# EAGLE design DoublePN-03092017-001 (EAGLE 8.3.1)
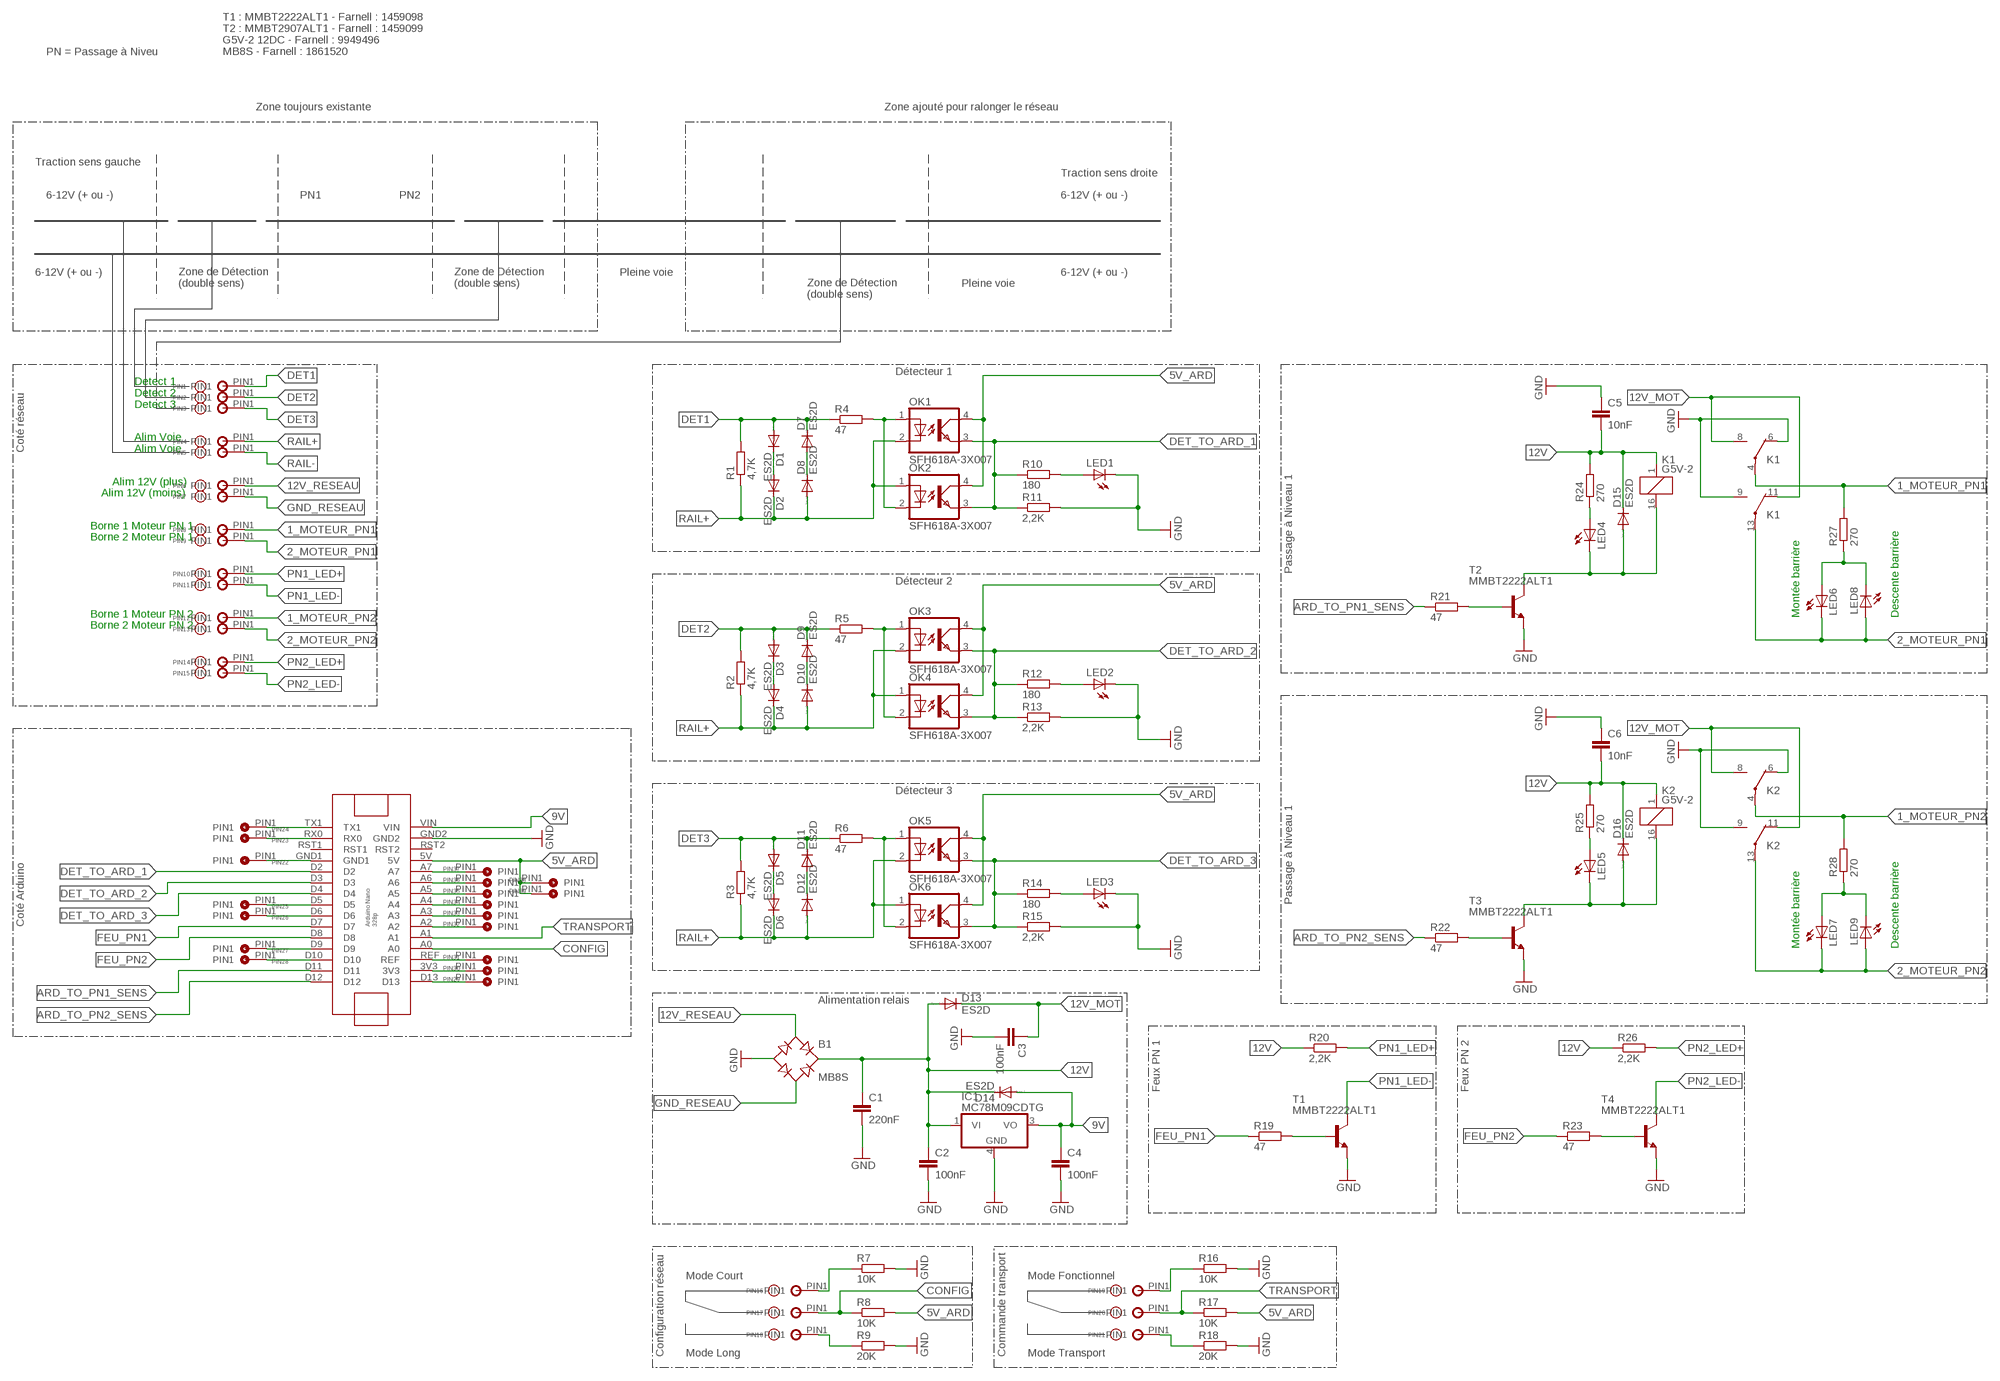
[diagram p0: schematic, sheet 1]

## Parts
ARDUINO-NANO1  ARDUINO-NANO  [ARDUINO-NANO]
B1  MB8S  [SOIC-4]
C1  220nF  C-EUC0805  [C0805]
C2  100nF  C-EUC0805  [C0805]
C3  100nF  C-EUC0805  [C0805]
C4  100nF  C-EUC0805  [C0805]
C5  10nF  C-EUC0805  [C0805]
C6  10nF  C-EUC0805  [C0805]
D1  ES2D  [SMB]
D2  ES2D  [SMB]
D3  ES2D  [SMB]
D4  ES2D  [SMB]
D5  ES2D  [SMB]
D6  ES2D  [SMB]
D7  ES2D  [SMB]
D8  ES2D  [SMB]
D9  ES2D  [SMB]
D10  ES2D  [SMB]
D11  ES2D  [SMB]
D12  ES2D  [SMB]
D13  ES2D  [SMB]
D14  ES2D  [SMB]
D15  ES2D  [SMB]
D16  ES2D  [SMB]
IC1  MC78M09CDTG  [DPACK_3]
K1  G5V-2  [G5V-2]
K2  G5V-2  [G5V-2]
LED1  LEDCHIPLED_0805  [CHIPLED_0805]
LED2  LEDCHIPLED_0805  [CHIPLED_0805]
LED3  LEDCHIPLED_0805  [CHIPLED_0805]
LED4  LEDCHIPLED_0805  [CHIPLED_0805]
LED5  LEDCHIPLED_0805  [CHIPLED_0805]
LED6  LEDCHIPLED_0805  [CHIPLED_0805]
LED7  LEDCHIPLED_0805  [CHIPLED_0805]
LED8  LEDCHIPLED_0805  [CHIPLED_0805]
LED9  LEDCHIPLED_0805  [CHIPLED_0805]
OK1  SFH618A-3X007  [SMD4-7]
OK2  SFH618A-3X007  [SMD4-7]
OK3  SFH618A-3X007  [SMD4-7]
OK4  SFH618A-3X007  [SMD4-7]
OK5  SFH618A-3X007  [SMD4-7]
OK6  SFH618A-3X007  [SMD4-7]
PIN1  CON-FILTRAVERSANT-1FILTRAVERSANT-1  [CON-FILTRAVERSANT-1]
PIN2  CON-FILTRAVERSANT-1FILTRAVERSANT-1  [CON-FILTRAVERSANT-1]
PIN3  CON-FILTRAVERSANT-1FILTRAVERSANT-1  [CON-FILTRAVERSANT-1]
PIN4  CON-FILTRAVERSANT-1FILTRAVERSANT-1  [CON-FILTRAVERSANT-1]
PIN5  CON-FILTRAVERSANT-1FILTRAVERSANT-1  [CON-FILTRAVERSANT-1]
PIN6  CON-FILTRAVERSANT-1FILTRAVERSANT-1  [CON-FILTRAVERSANT-1]
PIN7  CON-FILTRAVERSANT-1FILTRAVERSANT-1  [CON-FILTRAVERSANT-1]
PIN8  CON-FILTRAVERSANT-1FILTRAVERSANT-1  [CON-FILTRAVERSANT-1]
PIN9  CON-FILTRAVERSANT-1FILTRAVERSANT-1  [CON-FILTRAVERSANT-1]
PIN10  CON-FILTRAVERSANT-1FILTRAVERSANT-1  [CON-FILTRAVERSANT-1]
PIN11  CON-FILTRAVERSANT-1FILTRAVERSANT-1  [CON-FILTRAVERSANT-1]
PIN12  CON-FILTRAVERSANT-1FILTRAVERSANT-1  [CON-FILTRAVERSANT-1]
PIN13  CON-FILTRAVERSANT-1FILTRAVERSANT-1  [CON-FILTRAVERSANT-1]
PIN14  CON-FILTRAVERSANT-1FILTRAVERSANT-1  [CON-FILTRAVERSANT-1]
PIN15  CON-FILTRAVERSANT-1FILTRAVERSANT-1  [CON-FILTRAVERSANT-1]
PIN16  CON-FILTRAVERSANT-1FILTRAVERSANT-1  [CON-FILTRAVERSANT-1]
PIN17  CON-FILTRAVERSANT-1FILTRAVERSANT-1  [CON-FILTRAVERSANT-1]
PIN18  CON-FILTRAVERSANT-1FILTRAVERSANT-1  [CON-FILTRAVERSANT-1]
PIN19  CON-FILTRAVERSANT-1FILTRAVERSANT-1  [CON-FILTRAVERSANT-1]
PIN20  CON-FILTRAVERSANT-1FILTRAVERSANT-1  [CON-FILTRAVERSANT-1]
PIN21  CON-FILTRAVERSANT-1FILTRAVERSANT-1  [CON-FILTRAVERSANT-1]
PIN22  CON-TRAV-1PIN  [CON-TRAV-1]
PIN23  CON-TRAV-1PIN  [CON-TRAV-1]
PIN24  CON-TRAV-1PIN  [CON-TRAV-1]
PIN25  CON-TRAV-1PIN  [CON-TRAV-1]
PIN26  CON-TRAV-1PIN  [CON-TRAV-1]
PIN27  CON-TRAV-1PIN  [CON-TRAV-1]
PIN28  CON-TRAV-1PIN  [CON-TRAV-1]
PIN29  CON-TRAV-1PIN  [CON-TRAV-1]
PIN30  CON-TRAV-1PIN  [CON-TRAV-1]
PIN31  CON-TRAV-1PIN  [CON-TRAV-1]
PIN32  CON-TRAV-1PIN  [CON-TRAV-1]
PIN33  CON-TRAV-1PIN  [CON-TRAV-1]
PIN34  CON-TRAV-1PIN  [CON-TRAV-1]
PIN35  CON-TRAV-1PIN  [CON-TRAV-1]
PIN36  CON-TRAV-1PIN  [CON-TRAV-1]
PIN37  CON-TRAV-1PIN  [CON-TRAV-1]
PIN38  CON-TRAV-1PIN  [CON-TRAV-1]
PIN39  CON-TRAV-1PIN  [CON-TRAV-1]
R1  4,7K  R-EU_R0805  [R0805]
R2  4,7K  R-EU_R0805  [R0805]
R3  4,7K  R-EU_R0805  [R0805]
R4  47  R-EU_R0805  [R0805]
R5  47  R-EU_R0805  [R0805]
R6  47  R-EU_R0805  [R0805]
R7  10K  R-EU_R0805  [R0805]
R8  10K  R-EU_R0805  [R0805]
R9  20K  R-EU_R0805  [R0805]
R10  180  R-EU_R0805  [R0805]
R11  2,2K  R-EU_R0805  [R0805]
R12  180  R-EU_R0805  [R0805]
R13  2,2K  R-EU_R0805  [R0805]
R14  180  R-EU_R0805  [R0805]
R15  2,2K  R-EU_R0805  [R0805]
R16  10K  R-EU_R0805  [R0805]
R17  10K  R-EU_R0805  [R0805]
R18  20K  R-EU_R0805  [R0805]
R19  47  R-EU_R0805  [R0805]
R20  2,2K  R-EU_R0805  [R0805]
R21  47  R-EU_R0805  [R0805]
R22  47  R-EU_R0805  [R0805]
R23  47  R-EU_R0805  [R0805]
R24  270  R-EU_R0805  [R0805]
R25  270  R-EU_R0805  [R0805]
R26  2,2K  R-EU_R0805  [R0805]
R27  270  R-EU_R0805  [R0805]
R28  270  R-EU_R0805  [R0805]
T1  MMBT2222ALT1  MMBT2222ALT1-NPN-SOT23-BEC  [SOT23-BEC]
T2  MMBT2222ALT1  MMBT2222ALT1-NPN-SOT23-BEC  [SOT23-BEC]
T3  MMBT2222ALT1  MMBT2222ALT1-NPN-SOT23-BEC  [SOT23-BEC]
T4  MMBT2222ALT1  MMBT2222ALT1-NPN-SOT23-BEC  [SOT23-BEC]

## Nets
1_MOTEUR_PN1: K1.4(1:P) PIN8.PIN1 R27.2
1_MOTEUR_PN2: K2.4(1:P) PIN12.PIN1 R28.2
2_MOTEUR_PN1: K1.13(2:P) LED6.C LED8.A PIN9.PIN1
2_MOTEUR_PN2: K2.13(2:P) LED7.C LED9.A PIN13.PIN1
5V_ARD: ARDUINO-NANO1.5V OK1.4(COL) OK2.4(COL) OK3.4(COL) OK4.4(COL) OK5.4(COL) OK6.4(COL) PIN38.PIN1 PIN39.PIN1 R8.2 R17.2
9V: ARDUINO-NANO1.VIN C4.1 D14.A IC1.3(VO)
12V: B1.+ C1.1 C2.1 C5.2 C6.2 D13.A D14.C D15.C D16.C IC1.1(VI) K1.1 K2.1 R20.1 R24.2 R25.2 R26.1
12V_MOT: C3.1 D13.C K1.8(1:S) K1.11(2:O) K2.8(1:S) K2.11(2:O)
12V_RESEAU: B1.~1(AC1) PIN6.PIN1
ARD_TO_PN1_SENS: ARDUINO-NANO1.D11 R21.1
ARD_TO_PN2_SENS: ARDUINO-NANO1.D12 R22.1
CONFIG: ARDUINO-NANO1.A0 PIN17.PIN1 R8.1
DET1: D1.A D7.C PIN1.PIN1 R1.2 R4.1
DET2: D3.A D9.C PIN2.PIN1 R2.2 R5.1
DET3: D5.A D11.C PIN3.PIN1 R3.2 R6.1
DET_TO_ARD_1: ARDUINO-NANO1.D2 OK1.3(EMIT) OK2.3(EMIT) R10.1 R11.1
DET_TO_ARD_2: ARDUINO-NANO1.D3 OK3.3(EMIT) OK4.3(EMIT) R12.1 R13.1
DET_TO_ARD_3: ARDUINO-NANO1.D4 OK5.3(EMIT) OK6.3(EMIT) R14.1 R15.1
FEU_PN1: ARDUINO-NANO1.D7 R19.1
FEU_PN2: ARDUINO-NANO1.D8 R23.1
GND: ARDUINO-NANO1.GND2 B1.- C1.2 C2.2 C3.2 C4.2 C5.1 C6.1 IC1.4(GND) K1.6(1:O) K1.9(2:S) K2.6(1:O) K2.9(2:S) LED1.C LED2.C LED3.C R7.2 R9.2 R11.2 R13.2 R15.2 R16.2 R18.2 T1.E T2.E T3.E T4.E
GND_RESEAU: B1.~2(AC2) PIN7.PIN1
N$1: OK1.1(A) OK2.2(C) R4.2
N$2: D1.C D2.A
N$3: D7.A D8.C
N$4: LED6.A LED8.C R27.1
N$5: R21.2 T2.B
N$6: LED1.A R10.2
N$7: D15.A K1.16 LED4.C T2.C
N$8: D3.C D4.A
N$9: LED4.A R24.1
N$10: D9.A D10.C
N$11: OK3.1(A) OK4.2(C) R5.2
N$12: LED2.A R12.2
N$13: D5.C D6.A
N$14: D11.A D12.C
N$15: OK5.1(A) OK6.2(C) R6.2
N$16: LED3.A R14.2
N$17: LED5.A R25.1
N$18: D16.A K2.16 LED5.C T3.C
N$19: ARDUINO-NANO1.GND1 PIN22.PIN1
N$20: LED7.A LED9.C R28.1
N$21: R23.2 T4.B
N$22: R19.2 T1.B
N$23: R22.2 T3.B
N$25: ARDUINO-NANO1.A7 PIN37.PIN1
N$26: ARDUINO-NANO1.A6 PIN36.PIN1
N$27: ARDUINO-NANO1.A5 PIN35.PIN1
N$28: ARDUINO-NANO1.A4 PIN34.PIN1
N$29: ARDUINO-NANO1.A3 PIN33.PIN1
N$30: ARDUINO-NANO1.A2 PIN32.PIN1
N$31: ARDUINO-NANO1.D10 PIN28.PIN1
N$32: ARDUINO-NANO1.D9 PIN27.PIN1
N$33: ARDUINO-NANO1.D6 PIN26.PIN1
N$34: ARDUINO-NANO1.D5 PIN25.PIN1
N$35: ARDUINO-NANO1.RX0 PIN23.PIN1
N$36: ARDUINO-NANO1.TX1 PIN24.PIN1
N$37: PIN16.PIN1 R7.1
N$38: PIN19.PIN1 R16.1
N$39: ARDUINO-NANO1.REF PIN31.PIN1
N$40: ARDUINO-NANO1.3V3 PIN30.PIN1
N$41: ARDUINO-NANO1.D13 PIN29.PIN1
N$42: PIN18.PIN1 R9.1
N$43: PIN21.PIN1 R18.1
PN1_LED+: PIN10.PIN1 R20.2
PN1_LED-: PIN11.PIN1 T1.C
PN2_LED+: PIN14.PIN1 R26.2
PN2_LED-: PIN15.PIN1 T4.C
RAIL+: D2.C D4.C D6.C D8.A D10.A D12.A OK1.2(C) OK2.1(A) OK3.2(C) OK4.1(A) OK5.2(C) OK6.1(A) PIN4.PIN1 R1.1 R2.1 R3.1
RAIL-: PIN5.PIN1
TRANSPORT: ARDUINO-NANO1.A1 PIN20.PIN1 R17.1
Unconnected: ARDUINO-NANO1.RST1 ARDUINO-NANO1.RST2

## Notes on the sheet
- PN = Passage à Niveu
- T1 : MMBT2222ALT1 - Farnell : 1459098
  T2 : MMBT2907ALT1 - Farnell : 1459099
  G5V-2 12DC - Farnell : 9949496
  MB8S - Farnell : 1861520
- Zone toujours existante | Zone ajouté pour ralonger le réseau
- Traction sens gauche
- Traction sens droite
- 6-12V (+ ou -) | PN1 | PN2 | 6-12V (+ ou -)
- 6-12V (+ ou -) | Pleine voie | 6-12V (+ ou -)
- Zone de Détection
  (double sens)
- Zone de Détection
  (double sens)
- Pleine voie
- Zone de Détection
  (double sens)
- Détecteur 1
- Detect 1
  Detect 2
  Detect 3
- Coté réseau
- Alim Voie
  Alim Voie
- Alim 12V (plus)
- Alim 12V (moins)
- Borne 1 Moteur PN 1
- Borne 2 Moteur PN 1
- Passage à Niveau 1
- Détecteur 2
- Borne 1 Moteur PN 2 | Montée barrière | Descente barrière
- Borne 2 Moteur PN 2
- Détecteur 3
- Passage à Niveau 1
- Coté Arduino
- Montée barrière | Descente barrière
- Alimentation relais
- Feux PN 1 | Feux PN 2
- Mode Court | Mode Fonctionnel
- Configuration réseau | Mode Long | Commande transport | Mode Transport

## Library data of the parts
ARDUINO-NANO1 = Arduino-nano:ARDUINO-NANO
B1 = rectifier:MB*S: Bridge Rectifier Source: http://www.fairchildsemi.com/ds/MB/MB6S.pdf
C1-C6 = rcl:C-EU: CAPACITOR, European symbol
D1-D16 = diode:ES2D: DIODE super fast rectifier, 2 A
IC1 = linear:MC78M: 500 mA Positive Voltage Regulators Source: Data sheet <http://www.onsemi.com/pub_link/Collateral/MC78M00-D.PDF>
K1 K2 = relay:G5V-2: OMRON PCB Relay Source: http://www.omron.com/ecb/products/pdf/en-g5v2.pdf; MPN: G5V-2 5DC; OC_FARNELL: 9949488; OC_NEWARK: 78K5703
LED1-LED9 = led:LED: LED OSRAM: - CHIPLED LG R971, LG N971, LY N971, LG Q971, LY Q971, LO R971, LY R971 LH N974, LH R974 LS Q976, LO Q976, LY Q976 LO Q996 - Hyper CHIPLED LW Q18S LB Q993, LB Q99A, LB R99A - SideLED LS A670, LO A670, LY A670, LG A670, LP A670 LB A673, LV A673, LT A673, LW A673 LH A674 LY A675 LS A676, LA A676, LO A676, LY A676, LW A676 LS A679, LY A679, LG A679 - Hyper Micro SIDELED® LS Y876, LA Y876, LO Y876, LY Y876 LT Y87S - SmartLED LW L88C, LW L88S LB L89C, LB L89S, LG L890 LS L89K, LO L89K, LY L89K LS L896, LA L896, LO L896, LY L896 - TOPLED LS T670, LO T670, LY T670, LG T670, LP T670 LSG T670, LSP T670, LSY T670, LOP T670, LYG T670 LG T671, LOG T671, LSG T671 LB T673, LV T673, LT T673, LW T673 LH T674 LS T676, LA T676, LO T676, LY T676, LB T676, LH T676, LSB T676, LW T676 LB T67C, LV T67C, LT T67C, LS T67K, LO T67K, LY T67K, LW E67C LS E67B, LA E67B, LO E67B, LY E67B, LB E67C, LV E67C, LT E67C LW T67C LS T679, LY T679, LG T679 LS T770, LO T770, LY T770, LG T770, LP T770 LB T773, LV T773, LT T773, LW T773 LH T774 LS E675, LA E675, LY E675, LS T675 LS T776, LA T776, LO T776, LY T776, LB T776 LHGB T686 LT T68C, LB T68C - Hyper Mini TOPLED® LB M676 - Mini TOPLED Santana® LG M470 LS M47K, LO M47K, LY M47K Source: http://www.osram.convergy.de LUXEON: - LUMILED® LXK2-PW12-R00, LXK2-PW12-S00, LXK2-PW14-U00, LXK2-PW14-V00 LXK2-PM12-R00, LXK2-PM12-S00, LXK2-PM14-U00 LXK2-PE12-Q00, LXK2-PE12-R00, LXK2-PE12-S00, LXK2-PE14-T00, LXK2-PE14-U00 LXK2-PB12-K00, LXK2-PB12-L00, LXK2-PB12-M00, LXK2-PB14-N00, LXK2-PB14-P00, LXK2-PB14-Q00 LXK2-PR12-L00, LXK2-PR12-M00, LXK2-PR14-Q00, LXK2-PR14-R00 LXK2-PD12-Q00, LXK2-PD12-R00, LXK2-PD12-S00 LXK2-PH12-R00, LXK2-PH12-S00 LXK2-PL12-P00, LXK2-PL12-Q00, LXK2-PL12-R00 Source: www.luxeon.com KINGBRIGHT: KA-3528ASYC Source: www.kingbright.com
OK1-OK6 = optocoupler:SFH618?*: Optocoupler, Phototransistor Output, Low Input Current Source: Data sheet <http://www.vishay.com/docs/83673/sfh618.pdf>; OC_FARNELL: unknown; OC_NEWARK: unknown
PIN1-PIN21 = Pin:CON-FILTRAVERSANT-1
PIN22-PIN39 = Pin:CON-TRAV-1
R1-R28 = rcl:R-EU_: RESISTOR, European symbol
T1-T4 = transistor:*-NPN-: NPN Transistror BF959 corrected 2008.03.06

## Board
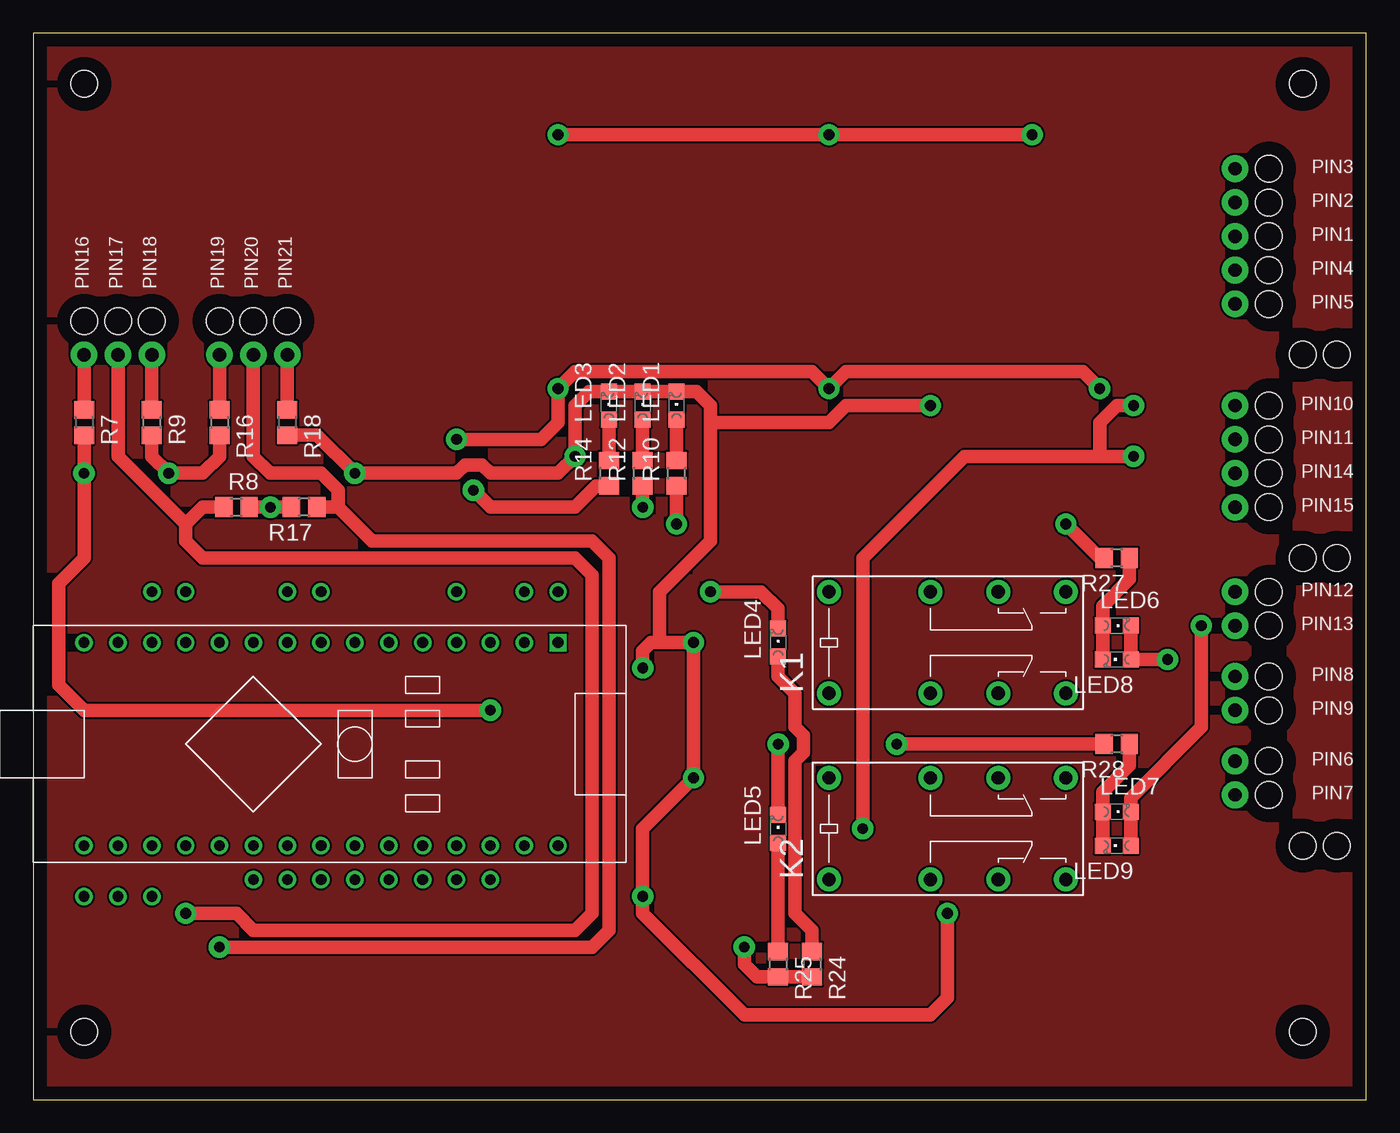
[diagram p1: board, top side]
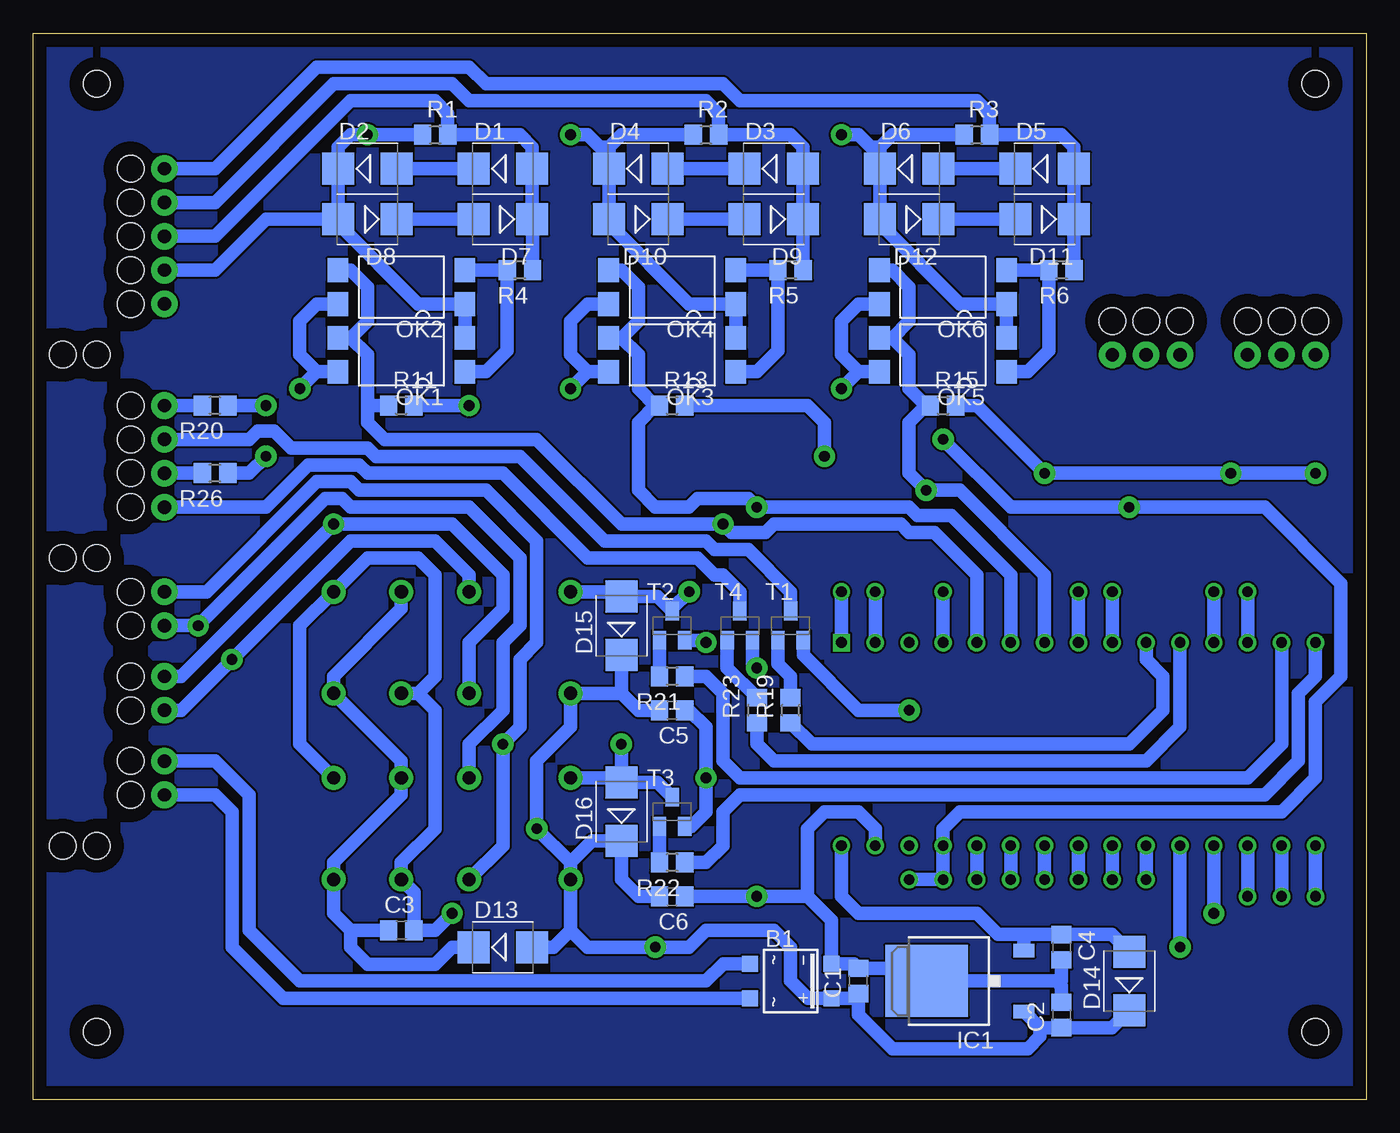
[diagram p2: board, bottom side, seen from below]

Size 100 x 80 mm. Coordinates in mm from the lower left corner, seen from the top.
Outline: 0,0 100,0 100,80 0,80 0,0
Copper layers (1*16): Top 0.035mm / dielectric 1.5mm / Bottom 0.035mm
Design rules "default": minimum track width 6mil, minimum drill 0.35mm, track to track 6mil, track to pad 6mil, pad to pad 6mil, via to via 6mil, smd to smd 6mil, copper to edge 40mil, drill to drill 6mil, minimum pad ring 10mil, minimum via ring 8mil, stop-mask expansion 4mil, vias tented up to drill 0mil, thermal gap 10mil
Holes 2 mm at 3.81,76.2 95.25,76.2 95.25,5.08 3.81,5.08 95.25,19.05 97.79,19.05 95.25,40.64 97.79,40.64 95.25,55.88 97.79,55.88

### Footprints (pad centres in the part's own frame; a part is rotated, then mirrored left to right if it is on the bottom)
ARDUINO-NANO = drill 0.8: 3V3 7.62,-16.51; 5V 7.62,8.89; A0 7.62,-11.43; A1 7.62,-8.89; A2 7.62,-6.35; A3 7.62,-3.81; A4 7.62,-1.27; A5 7.62,1.27; A6 7.62,3.81; A7 7.62,6.35; D2 -7.62,6.35; D3 -7.62,3.81; D4 -7.62,1.27; D5 -7.62,-1.27; D6 -7.62,-3.81; D7 -7.62,-6.35; D8 -7.62,-8.89; D9 -7.62,-11.43; D10 -7.62,-13.97; D11 -7.62,-16.51; D12 -7.62,-19.05; D13 7.62,-19.05; GND1 -7.62,8.89; GND2 7.62,13.97; REF 7.62,-13.97; RST1 -7.62,11.43; RST2 7.62,11.43; RX0 -7.62,13.97; VIN 7.62,16.51 | drill 0.8 square: TX1 -7.62,16.51
SOIC-4 = smd 1.2 x 1.2: + 1.3,3.05; - -1.3,3.05; ~1 -1.3,-3.05; ~2 1.3,-3.05
C0805 = smd 1.3 x 1.5: 1 -0.95,0; 2 0.95,0
SMB = smd 2.4 x 2.4: A 2.2,0; C -2.2,0
DPACK_3 = smd 1 x 1.6: 1 -2.28,-4.8; 3 2.28,-4.8 | smd 5.4 x 6.2: 4 0,2.5
G5V-2 = drill 1 pad 1.8: 1 -8.89,-3.81; 4 -1.27,-3.81; 6 3.81,-3.81; 8 8.89,-3.81; 9 8.89,3.81; 11 3.81,3.81; 13 -1.27,3.81; 16 -8.89,3.81
CHIPLED_0805 = smd 1.2 x 1.2: A 0,-1.05; C 0,1.05
SMD4-7 = smd 1.78 x 1.55: 1 -1.27,-4.77; 2 1.27,-4.77; 3 1.27,4.77; 4 -1.27,4.77
CON-FILTRAVERSANT-1 = drill 1 pad 2: PIN1 0,0 | hole 2: -2.54,0
CON-TRAV-1 = drill 0.8 pad 1.2: PIN1 0,0
R0805 = smd 1.3 x 1.5: 1 -0.95,0; 2 0.95,0
SOT23-BEC = smd 1 x 1.4: B -0.95,-1.1; C 0,1.1; E 0.95,-1.1

### Placement (x,y rotation side)
ARDUINO-NANO1  22.86,26.67 270 top
B1  43.18,8.89 270 bottom
C1  38.1,8.89 90 bottom
C2  22.86,6.35 90 bottom
C3  72.39,12.7 0 bottom
C4  22.86,11.43 270 bottom
C5  52.07,29.21 180 bottom
C6  52.07,15.24 180 bottom
D1  64.77,69.85 0 bottom
D2  74.93,69.85 0 bottom
D3  44.45,69.85 0 bottom
D4  54.61,69.85 0 bottom
D5  24.13,69.85 0 bottom
D6  34.29,69.85 0 bottom
D7  64.77,66.04 180 bottom
D8  74.93,66.04 180 bottom
D9  44.45,66.04 180 bottom
D10  54.61,66.04 180 bottom
D11  24.13,66.04 180 bottom
D12  34.29,66.04 180 bottom
D13  64.77,11.43 0 bottom
D14  17.78,8.89 90 bottom
D15  55.88,35.56 90 bottom
D16  55.88,21.59 90 bottom
IC1  30.48,8.89 90 bottom
K1  68.58,34.29 0 top
K2  68.58,20.32 0 top
LED1  48.26,52.07 0 top
LED2  45.72,52.07 0 top
LED3  43.18,52.07 0 top
LED4  55.88,34.29 0 top
LED5  55.88,20.32 0 top
LED6  81.28,35.56 270 top
LED7  81.28,21.59 270 top
LED8  81.28,33.02 90 top
LED9  81.28,19.05 90 top
OK1  72.39,55.88 90 bottom
OK2  72.39,60.96 90 bottom
OK3  52.07,55.88 90 bottom
OK4  52.07,60.96 90 bottom
OK5  31.75,55.88 90 bottom
OK6  31.75,60.96 90 bottom
PIN1  90.17,64.77 180 top
PIN2  90.17,67.31 180 top
PIN3  90.17,69.85 180 top
PIN4  90.17,62.23 180 top
PIN5  90.17,59.69 180 top
PIN6  90.17,25.4 180 top
PIN7  90.17,22.86 180 top
PIN8  90.17,31.75 180 top
PIN9  90.17,29.21 180 top
PIN10  90.17,52.07 180 top
PIN11  90.17,49.53 180 top
PIN12  90.17,38.1 180 top
PIN13  90.17,35.56 180 top
PIN14  90.17,46.99 180 top
PIN15  90.17,44.45 180 top
PIN16  3.81,55.88 270 top
PIN17  6.35,55.88 270 top
PIN18  8.89,55.88 270 top
PIN19  13.97,55.88 270 top
PIN20  16.51,55.88 270 top
PIN21  19.05,55.88 270 top
PIN22  31.75,38.1 0 top
PIN23  36.83,38.1 0 top
PIN24  39.37,38.1 0 top
PIN25  21.59,38.1 0 top
PIN26  19.05,38.1 0 top
PIN27  11.43,38.1 0 top
PIN28  8.89,38.1 0 top
PIN29  3.81,15.24 0 top
PIN30  6.35,15.24 0 top
PIN31  8.89,15.24 0 top
PIN32  16.51,16.51 0 top
PIN33  19.05,16.51 0 top
PIN34  21.59,16.51 0 top
PIN35  24.13,16.51 0 top
PIN36  26.67,16.51 0 top
PIN37  29.21,16.51 0 top
PIN38  31.75,16.51 0 top
PIN39  34.29,16.51 0 top
R1  69.85,72.39 0 bottom
R2  49.53,72.39 0 bottom
R3  29.21,72.39 0 bottom
R4  63.5,62.23 180 bottom
R5  43.18,62.23 180 bottom
R6  22.86,62.23 180 bottom
R7  3.81,50.8 270 top
R8  15.24,44.45 0 top
R9  8.89,50.8 270 top
R10  48.26,46.99 90 top
R11  72.39,52.07 0 bottom
R12  45.72,46.99 90 top
R13  52.07,52.07 0 bottom
R14  43.18,46.99 90 top
R15  31.75,52.07 0 bottom
R16  13.97,50.8 270 top
R17  20.32,44.45 180 top
R18  19.05,50.8 270 top
R19  43.18,29.21 90 bottom
R20  86.36,52.07 180 bottom
R21  52.07,31.75 180 bottom
R22  52.07,17.78 180 bottom
R23  45.72,29.21 90 bottom
R24  58.42,10.16 270 top
R25  55.88,10.16 270 top
R26  86.36,46.99 180 bottom
R27  81.28,40.64 180 top
R28  81.28,26.67 180 top
T1  43.18,35.56 0 bottom
T2  52.07,35.56 0 bottom
T3  52.07,21.59 0 bottom
T4  46.99,35.56 0 bottom

### Tracks (layer width: path | path; a pad name or v marks a point on that pad's centre or on a via)
1_MOTEUR_PN1  (via drill 0.8 pad 1.6)
  Top 1: R27.2 80.01,40.64 v77.47,43.18
  Bottom 1: K1.4 67.31,34.29 64.77,36.83 64.77,39.37 68.58,43.18 v77.47,43.18 88.9,31.75 PIN8.PIN1
1_MOTEUR_PN2  (via drill 0.8 pad 1.6)
  Top 1: R28.2 v64.77,26.67
  Bottom 1: K2.4 64.77,19.05 v64.77,26.67 63.5,27.94 63.5,33.02 62.23,34.29 62.23,41.91 66.04,45.72 75.56,45.72 76.2,46.35 78.74,46.35 87,38.1 PIN12.PIN1
2_MOTEUR_PN1  (via drill 0.8 pad 1.6)
  Top 1: LED6.C LED8.A v85.09,33.02
  Bottom 1: K1.13 67.31,39.37 69.85,41.91 76.2,41.91 v85.09,33.02 88.9,29.21 PIN9.PIN1
2_MOTEUR_PN2  (via drill 0.8 pad 1.6)
  Top 1: LED9.A LED7.C 82.33,22.64 87.63,27.94 v87.63,35.56
  Bottom 1: K2.13 67.31,26.67 64.77,29.21 64.77,34.29 63.5,35.56 63.5,40.64 67.31,44.45 76.2,44.45 76.83,45.09 78.11,45.09 v87.63,35.56 PIN13.PIN1
5V_ARD  (via drill 0.8 pad 1.6)
  Top 1: R17.2 v17.78,44.45 R8.2 | v31.75,49.53 38.1,49.53 39.37,50.8 v39.37,53.34 40.64,54.61 58.42,54.61 v59.69,53.34 60.96,54.61 78.74,54.61 v80.01,53.34
  Bottom 1: PIN39.PIN1 PIN38.PIN1 ARDUINO-NANO1.5V 31.75,20.32 30.48,21.59 6.35,21.59 3.81,24.13 3.81,29.84 1.91,31.75 1.91,38.73 7.62,44.45 v17.78,44.45 26.67,44.45 v31.75,49.53 | OK6.4 38.1,59.69 39.37,58.42 39.37,55.88 38.1,54.61 | 38.1,54.61 OK5.4 | OK4.4 58.42,59.69 59.69,58.42 59.69,55.88 58.42,54.61 | 58.42,54.61 OK3.4 | 38.1,54.61 v39.37,53.34 | 58.42,54.61 v59.69,53.34 | OK2.4 78.74,59.69 80.01,58.42 80.01,55.88 78.74,54.61 | 78.74,54.61 OK1.4 | 78.74,54.61 v80.01,53.34
9V
  Bottom 1: D14.A 19.07,12.38 C4.1 25.71,12.38 | 25.71,12.38 27.62,12.38 29.21,13.97 38.1,13.97 39.37,15.24 ARDUINO-NANO1.VIN | IC1.3 25.68,12.35 25.71,12.38
12V  (via drill 0.8 pad 1.6)
  Top 1: v62.23,20.32 62.23,40.64 69.85,48.26 79.9,48.26 | 79.9,48.26 v82.55,48.26 | v82.55,52.07 81.28,52.07 80.01,50.8 80.01,48.37 79.9,48.26 | R24.2 R25.2 54.29,9.21 53.34,10.16 v53.34,11.43
  Bottom 1: 24.47,5.4 C2.1 19.07,5.4 D14.C | 24.47,5.4 IC1.1 | 59.69,17.78 K2.1 59.69,12.7 | 59.69,17.78 58.08,19.39 D16.C 55.88,16.51 54.61,15.24 C6.2 | 59.69,17.78 v62.23,20.32 62.23,25.4 59.69,27.94 K1.1 55.88,30.48 | D15.C 55.88,30.48 | 55.88,30.48 54.61,29.21 C5.2 | 59.69,12.7 60.96,11.43 D13.A | 59.69,12.7 58.42,11.43 v53.34,11.43 50.8,11.43 49.53,12.7 44.45,12.7 43.18,11.43 43.18,8.89 41.88,7.59 B1.+ 38.45,7.59 C1.1 38.1,6.35 35.56,3.81 25.4,3.81 24.47,4.74 24.47,5.4 | R26.1 83.82,46.99 v82.55,48.26 | R20.1 v82.55,52.07
12V_MOT
  Bottom 1: D13.C 68.58,11.43 69.85,10.16 74.93,10.16 76.2,11.43 76.2,12.7 | K1.11 72.39,36.83 77.47,31.75 K1.8 72.39,25.4 K2.11 72.39,22.86 77.47,17.78 K2.8 77.47,13.97 76.2,12.7 | C3.1 76.2,12.7
12V_RESEAU
  Bottom 1: B1.~1 48.23,10.19 49.53,8.89 80.01,8.89 83.82,12.7 83.82,22.86 86.36,25.4 PIN6.PIN1
ARD_TO_PN1_SENS
  Bottom 1: R21.1 49.53,31.75 48.26,30.48 48.26,25.4 46.99,24.13 8.89,24.13 6.35,26.67 ARDUINO-NANO1.D11
ARD_TO_PN2_SENS
  Bottom 1: R22.1 49.53,17.78 48.26,19.05 48.26,21.59 46.99,22.86 7.62,22.86 5.08,25.4 5.08,30.48 3.81,31.75 ARDUINO-NANO1.D12
CONFIG  (via drill 0.8 pad 1.6)
  Top 1: R8.1 12.7,44.45 11.43,43.18 | 11.43,43.18 11.43,41.91 12.7,40.64 40.64,40.64 41.91,39.37 41.91,13.97 40.64,12.7 16.51,12.7 15.24,13.97 v11.43,13.97 | PIN17.PIN1 6.35,48.26 11.43,43.18
  Bottom 1: ARDUINO-NANO1.A0 v11.43,13.97
DET1
  Bottom 1: R4.1 62.55,66.02 D7.C D1.A 62.57,71.46 63.5,72.39 R1.2 68.9,73.98 69.85,74.93 76.2,74.93 86.36,64.77 PIN1.PIN1
DET2
  Bottom 1: R5.1 42.25,62.25 D9.C D3.A 42.25,71.46 43.18,72.39 R2.2 48.58,73.98 49.53,74.93 67.31,74.93 68.58,76.2 77.47,76.2 86.36,67.31 PIN2.PIN1
DET3
  Bottom 1: R6.1 21.93,62.25 D11.C D5.A 21.93,71.46 22.86,72.39 R3.2 28.26,73.98 29.21,74.93 46.99,74.93 48.26,76.2 66.04,76.2 67.31,77.47 78.74,77.47 86.36,69.85 PIN3.PIN1
DET_TO_ARD_1  (via drill 0.8 pad 1.6)
  Top 1: R10.1 v48.26,43.18
  Bottom 1: OK2.3 76.2,62.23 74.93,60.96 74.93,58.42 76.2,57.15 | 76.2,57.15 OK1.3 | 76.2,57.15 74.93,55.88 74.93,52.07 | 73.66,52.07 R11.1 74.93,52.07 | ARDUINO-NANO1.D2 29.21,39.37 32.38,42.55 34.29,42.55 34.92,43.18 44.45,43.18 45.09,42.55 47.62,42.55 v48.26,43.18 55.88,43.18 62.23,49.53 73.66,49.53 74.93,50.8 74.93,52.07
DET_TO_ARD_2  (via drill 0.8 pad 1.6)
  Top 1: R12.1 v45.72,44.45
  Bottom 1: 53.34,52.07 54.61,53.34 54.61,55.88 55.88,57.15 | 55.88,57.15 OK3.3 | 55.88,57.15 54.61,58.42 54.61,60.96 55.88,62.23 OK4.3 | R13.1 53.34,52.07 | 53.34,52.07 54.61,50.8 54.61,45.72 53.34,44.45 50.8,44.45 50.16,45.09 46.35,45.09 v45.72,44.45 34.29,44.45 33.66,43.81 31.11,43.81 26.67,39.37 ARDUINO-NANO1.D3
DET_TO_ARD_3  (via drill 0.8 pad 1.6)
  Top 1: R14.1 42.23,46.04 40.64,44.45 34.29,44.45 v33.02,45.72
  Bottom 1: 33.02,52.07 34.29,53.34 34.29,55.88 35.56,57.15 | 35.56,57.15 OK5.3 | 35.56,57.15 34.29,58.42 34.29,60.96 35.56,62.23 OK6.3 | R15.1 33.02,52.07 | 33.02,52.07 34.29,50.8 34.29,46.99 v33.02,45.72 30.48,45.72 24.13,39.37 ARDUINO-NANO1.D4
FEU_PN1
  Bottom 1: ARDUINO-NANO1.D7 16.51,33.02 15.24,31.75 15.24,29.21 17.78,26.67 41.59,26.67 R19.1
FEU_PN2
  Bottom 1: ARDUINO-NANO1.D8 13.97,27.94 16.51,25.4 44.45,25.4 45.72,26.67 R23.1
GND  (via drill 0.8 pad 1.6)
  Top 1: R7.2 v3.81,46.99 3.81,40.64 1.91,38.73 1.91,31.11 3.81,29.21 v34.29,29.21 | R9.2 8.89,48.26 v10.16,46.99 12.7,46.99 13.97,48.26 R16.2 | R18.2 21.27,49.85 v24.13,46.99 31.75,46.99 32.38,47.62 33.66,47.62 34.29,46.99 39.37,46.99 v40.64,48.26 40.64,52.07 41.69,53.12 LED3.C LED2.C LED1.C 49.75,53.12 50.8,52.07 50.8,50.57 | 50.8,50.57 50.8,41.91 46.99,38.1 46.99,34.29 | 46.99,34.29 v49.53,34.29 v49.53,24.13 45.72,20.32 v45.72,15.24 45.72,13.97 53.34,6.35 67.31,6.35 68.58,7.62 v68.58,13.97 | v67.31,52.07 60.96,52.07 59.69,50.8 51.03,50.8 50.8,50.57 | 46.99,34.29 46.35,34.29 45.72,33.66 v45.72,32.38
  Bottom 1: 23.2,8.89 IC1.4 33.93,9.84 C1.2 38.45,10.19 B1.- 40.13,13.46 41.91,15.24 | 23.2,8.89 22.86,8.89 C4.2 | C2.2 22.86,8.55 23.2,8.89 | 41.91,15.24 41.91,20.32 40.64,21.59 38.1,21.59 36.83,20.32 ARDUINO-NANO1.GND2 | 71.12,30.48 69.85,29.21 69.85,20.32 72.39,17.78 K2.6 71.44,15.56 C3.2 69.85,12.7 v68.58,13.97 | 71.12,30.48 K1.6 | 71.12,30.48 69.85,31.75 69.85,39.37 71.12,40.64 74.93,40.64 K1.9 80.01,35.56 80.01,26.67 K2.9 | v3.81,46.99 v10.16,46.99 v24.13,46.99 29.21,52.07 R15.2 | R13.2 41.91,52.07 40.64,50.8 v40.64,48.26 | T2.E 49.7,34.46 v49.53,34.29 | T1.E 42.23,33.34 38.1,29.21 v34.29,29.21 | T3.E 50.63,20.49 49.53,21.59 v49.53,24.13 49.53,27.94 50.8,29.21 C5.1 | 41.91,15.24 v45.72,15.24 C6.1 | R11.2 v67.31,52.07 | v45.72,32.38 46.04,32.7 T4.E
GND_RESEAU
  Bottom 1: B1.~2 81.25,7.59 85.09,11.43 85.09,21.59 86.36,22.86 PIN7.PIN1
N$1
  Bottom 1: OK2.2 R4.2 64.45,56.2 66.04,54.61 OK1.1
N$2
  Bottom 1: D1.C D2.A
N$3
  Bottom 1: D7.A D8.C
N$4
  Top 1: LED8.C LED6.A 80.23,37.05 82.23,39.05 R27.1
N$5
  Bottom 1: T2.B R21.2
N$6
  Top 1: LED1.A R10.2
N$7  (via drill 0.8 pad 1.6)
  Top 1: LED4.C 55.88,36.83 54.61,38.1 v50.8,38.1
  Bottom 1: K1.16 56.22,38.1 D15.A 53.17,37.76 T2.C 52.07,36.83 v50.8,38.1
N$8
  Bottom 1: D3.C D4.A
N$9
  Top 1: R24.1 58.42,12.7 57.15,13.97 57.15,25.4 57.78,26.04 57.78,27.3 57.15,27.94 57.15,30.48 55.88,31.75 LED4.A
N$10
  Bottom 1: D9.A D10.C
N$11
  Bottom 1: OK4.2 R5.2 44.13,56.2 45.72,54.61 OK3.1
N$12
  Top 1: LED2.A R12.2
N$13
  Bottom 1: D5.C D6.A
N$14
  Bottom 1: D11.A D12.C
N$15
  Bottom 1: OK6.2 R6.2 23.81,56.2 25.4,54.61 OK5.1
N$16
  Top 1: LED3.A R14.2
N$17
  Top 1: LED5.A R25.1
N$18  (via drill 0.8 pad 1.6)
  Top 1: LED5.C v55.88,26.67
  Bottom 1: 56.22,24.13 D16.A 53.17,23.79 T3.C | K2.16 56.22,24.13 | v55.88,26.67 55.88,24.47 56.22,24.13
N$19
  Bottom 1: PIN22.PIN1 ARDUINO-NANO1.GND1
N$20
  Top 1: LED9.C LED7.A 80.23,23.08 82.23,25.08 R28.1
N$21
  Bottom 1: T4.B 47.94,32.38 R23.2
N$22
  Bottom 1: T1.B 44.13,32.7 43.18,31.75 R19.2
N$23
  Bottom 1: T3.B R22.2
N$24
  pour Bottom: 0,80.01 100.33,80.01 100.33,0 0,0
N$25
  Bottom 1: ARDUINO-NANO1.A7 PIN37.PIN1
N$26
  Bottom 1: ARDUINO-NANO1.A6 PIN36.PIN1
N$27
  Bottom 1: ARDUINO-NANO1.A5 PIN35.PIN1
N$28
  Bottom 1: ARDUINO-NANO1.A4 PIN34.PIN1
N$29
  Bottom 1: ARDUINO-NANO1.A3 PIN33.PIN1
N$30
  Bottom 1: ARDUINO-NANO1.A2 PIN32.PIN1
N$31
  Bottom 1: PIN28.PIN1 ARDUINO-NANO1.D10
N$32
  Bottom 1: PIN27.PIN1 ARDUINO-NANO1.D9
N$33
  Bottom 1: PIN26.PIN1 ARDUINO-NANO1.D6
N$34
  Bottom 1: PIN25.PIN1 ARDUINO-NANO1.D5
N$35
  Bottom 1: PIN23.PIN1 ARDUINO-NANO1.RX0
N$36
  Bottom 1: PIN24.PIN1 ARDUINO-NANO1.TX1
N$37
  Top 1: PIN16.PIN1 R7.1
N$38
  Top 1: PIN19.PIN1 R16.1
N$39
  Bottom 1: ARDUINO-NANO1.REF PIN31.PIN1
N$40
  Bottom 1: ARDUINO-NANO1.3V3 PIN30.PIN1
N$41
  Bottom 1: ARDUINO-NANO1.D13 PIN29.PIN1
N$42
  Top 1: PIN18.PIN1 R9.1
N$43
  Top 1: PIN21.PIN1 R18.1
N$44
  pour Top: 0,80.01 100.33,80.01 100.33,0 0,0
PN1_LED+
  Bottom 1: PIN10.PIN1 R20.2
PN1_LED-
  Bottom 1: T1.C 43.18,38.1 46.35,41.27 48.9,41.27 49.53,41.91 57.15,41.91 63.5,48.26 74.3,48.26 74.93,48.9 80.64,48.9 81.92,50.16 83.19,50.16 83.82,49.53 PIN11.PIN1
PN2_LED+
  Bottom 1: PIN14.PIN1 R26.2
PN2_LED-
  Bottom 1: T4.C 46.99,38.1 48.26,39.37 48.9,39.37 50.16,40.64 58.42,40.64 64.77,46.99 74.93,46.99 75.56,47.62 79.38,47.62 82.55,44.45 PIN15.PIN1
RAIL+  (via drill 0.8 pad 1.6)
  Top 1: v39.37,72.39 v59.69,72.39 v74.93,72.39
  Bottom 1: OK5.2 OK6.1 30.48,59.69 36.49,65.7 D12.A D6.C 36.49,71.46 | OK3.2 OK4.1 50.8,59.69 56.81,65.7 D10.A D4.C 56.81,71.46 | 77.13,66.18 D2.C 77.13,71.46 76.2,72.39 v74.93,72.39 R1.1 | 77.13,66.18 D8.A | 77.27,66.04 77.13,66.18 | 36.49,71.46 35.56,72.39 R3.1 | 36.49,71.46 37.17,71.46 38.1,72.39 v39.37,72.39 | 56.81,71.46 55.88,72.39 R2.1 | 56.81,71.46 57.49,71.46 58.42,72.39 v59.69,72.39 | PIN4.PIN1 86.36,62.23 82.55,66.04 D8.A | D8.A 77.13,65.7 71.12,59.69 OK2.1 OK1.2
TRANSPORT  (via drill 0.8 pad 1.6)
  Top 1: 22.86,44.45 R17.1 | 22.86,44.45 25.4,41.91 41.91,41.91 43.18,40.64 43.18,12.7 41.91,11.43 v13.97,11.43 | PIN20.PIN1 16.51,48.26 17.78,46.99 21.59,46.99 22.86,45.72 22.86,44.45
  Bottom 1: v13.97,11.43 ARDUINO-NANO1.A1